# EasyEDA Pro project 4040M主控板.eprj, board PCB
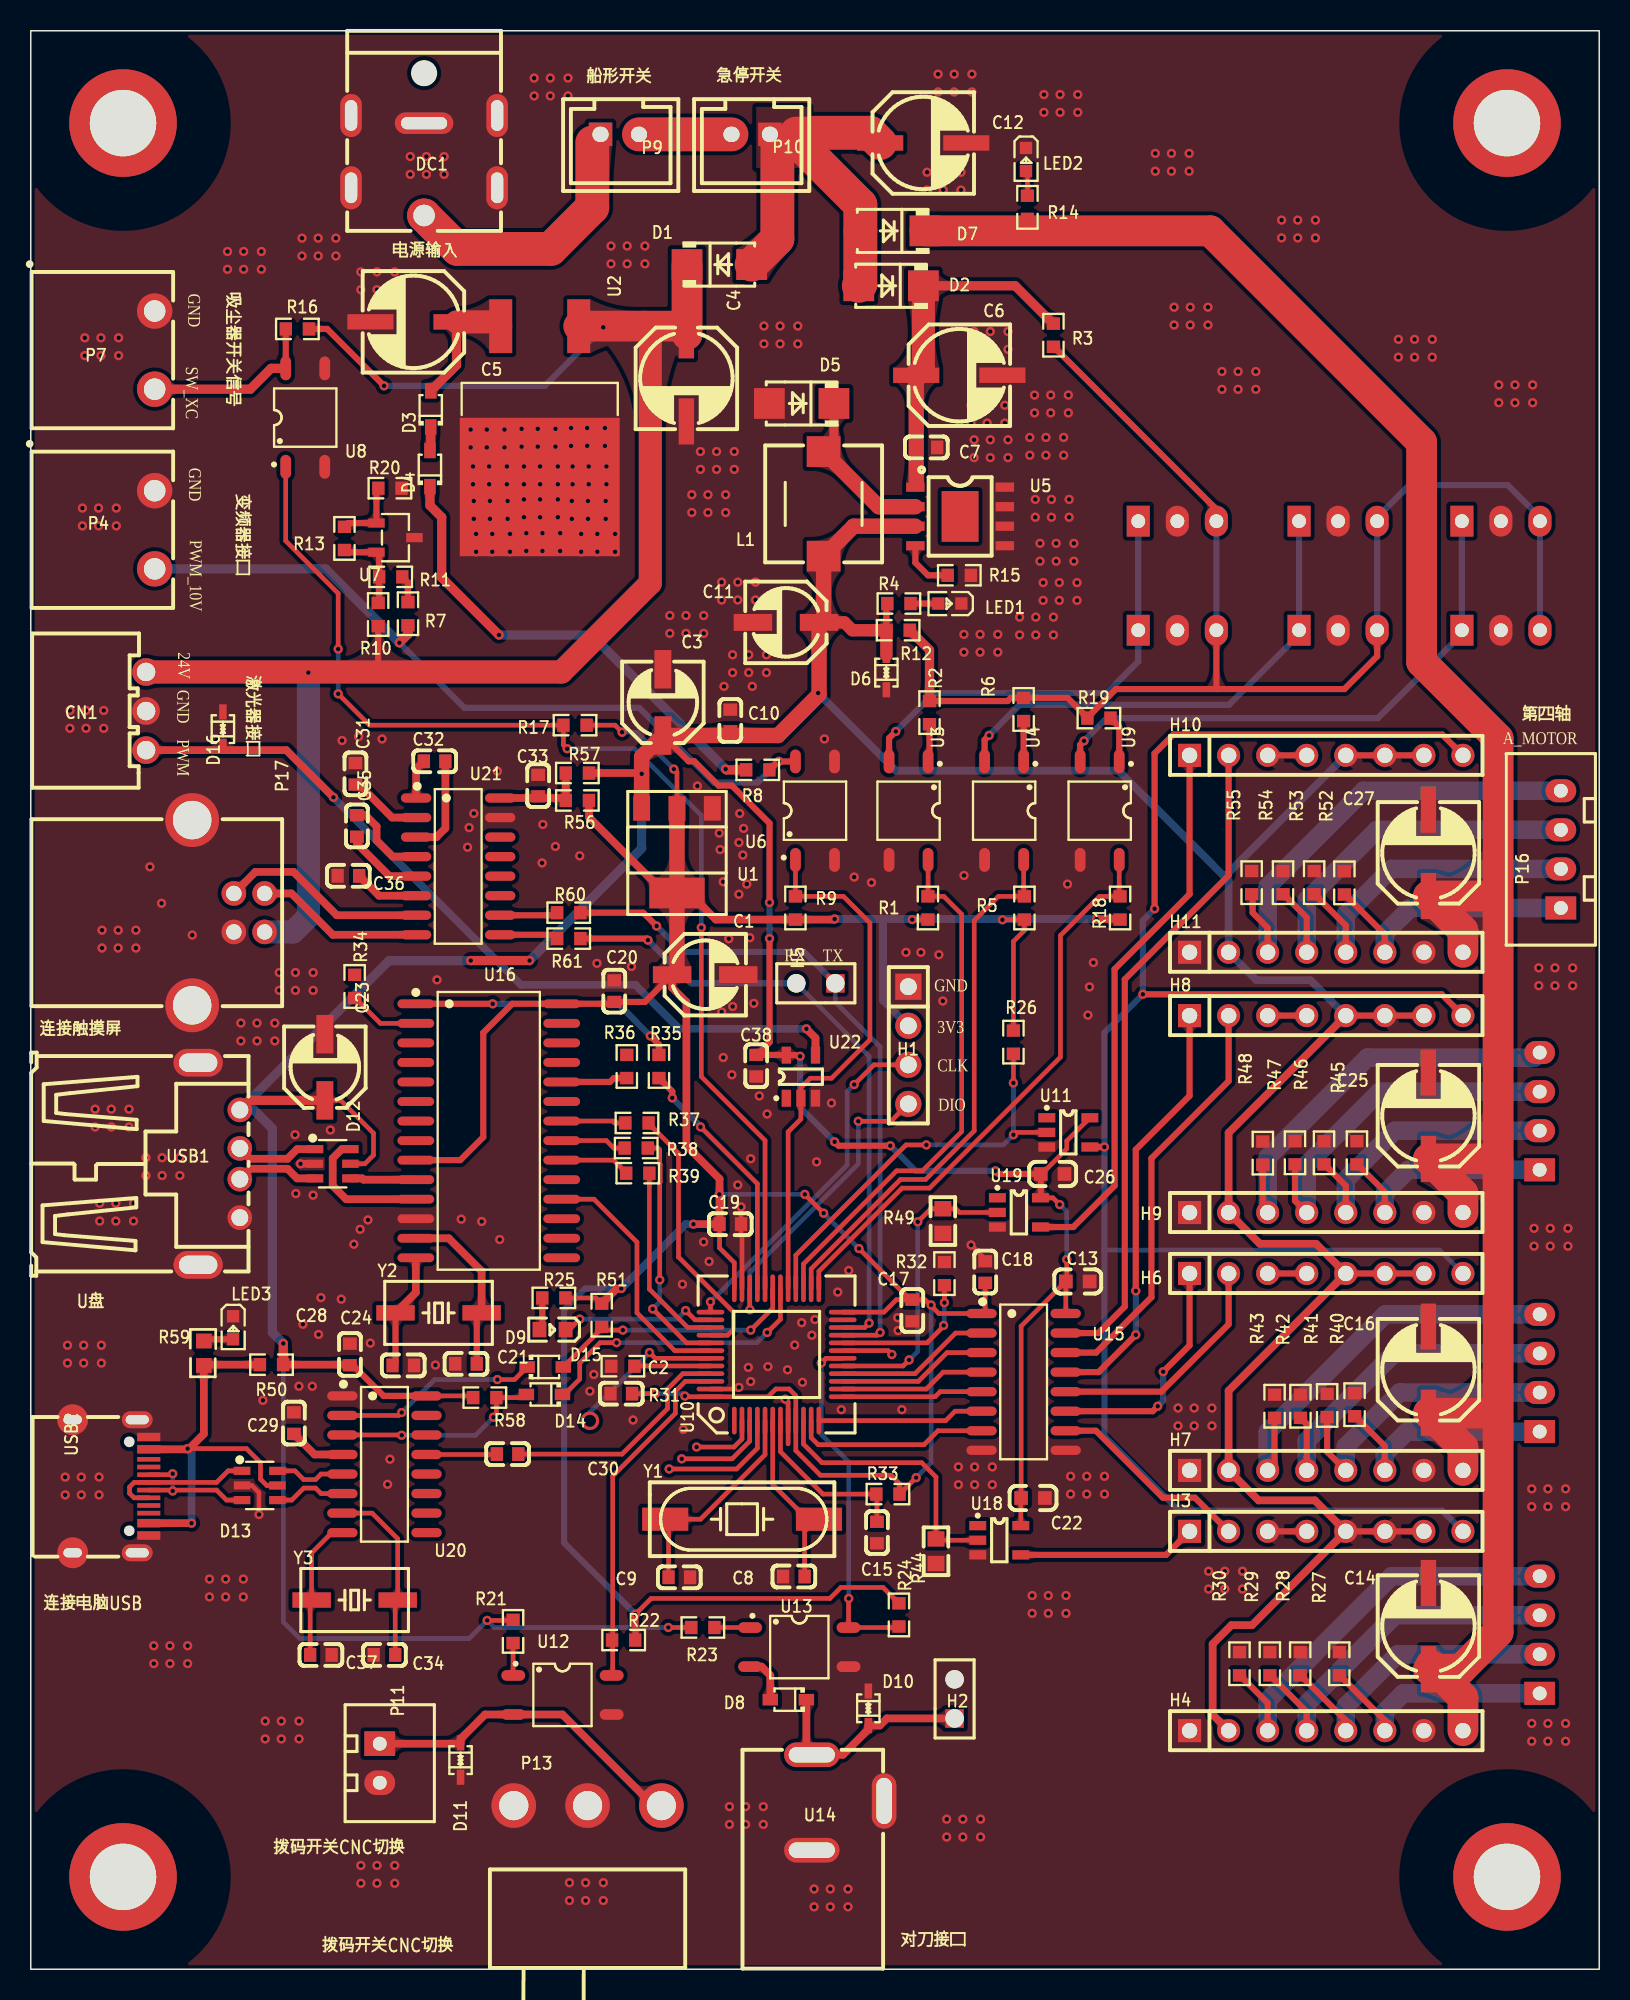
[diagram p1: board, top side]
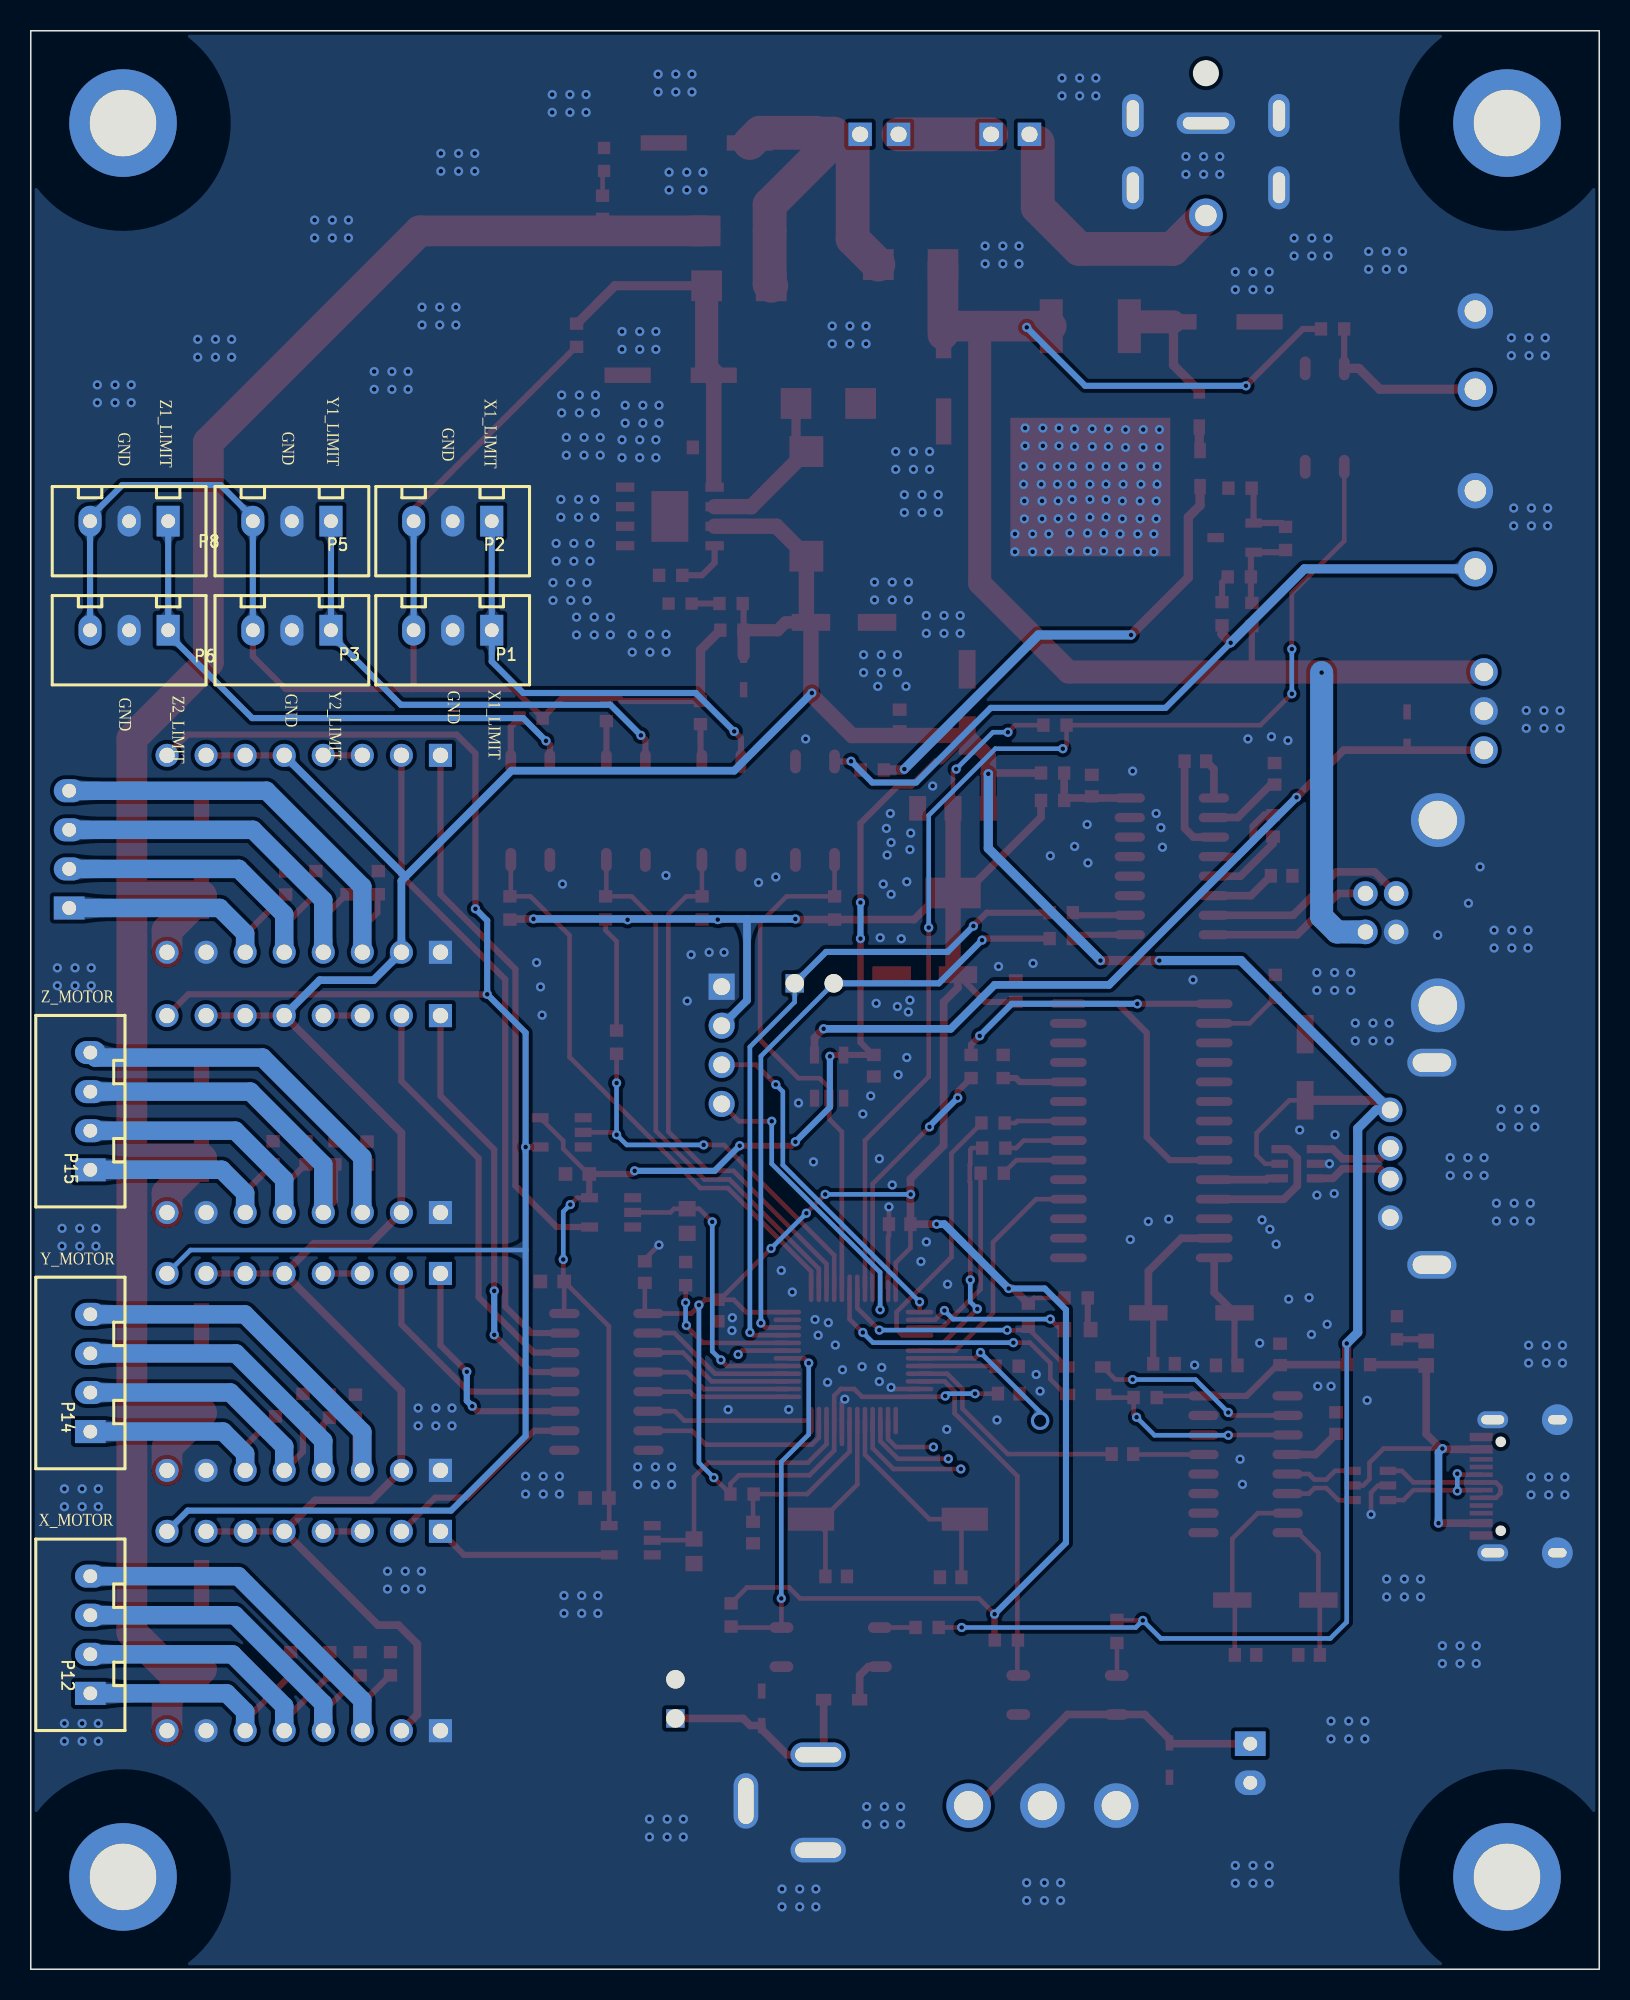
[diagram p2: board, bottom side, seen from below]

Outline 102 x 126 mm; copper layers: Top Layer, Bottom Layer. Coordinates in mm from the lower left corner of the outline.
Outline path: rectangle 0,126 102,0
Stack: Top Layer 0.035mm / Dielectric1 1.51mm FR4 er 4.5 / Bottom Layer 0.035mm

## Design rules (mm)
net D1-: DP1
net D1+: DP1
net DP_D+: DP2
net DN_D-: DP2
net DP+: DP3
net DN-: DP3
template: 用户自定义配置
spacing Default (default): track to track 0.152, other pairs 0 to 0.152
track width Default (default): min 0.254, default 0.254, max 25.4
differential pair differentialPair (default): width min 0.127, default 0.254, max 2.54; gap min 0.152, default 0.152
via Default (default): diameter min 0.25, default 0.61, max 100.025; hole min 0.2, default 0.305, max 59.995

## Placement (name value [footprint] x y rotation side)
C1  100uF/10V  [CAP-SMD_BD5.0-L5.3-W5.3-RD]  43.86 64.65 180 top
C2  0.1uF  [C0603]  38.4 37.41 0 top
C3  100uF/10V  [CAP-SMD_BD5.0-L5.3-W5.3-RD]  41.11 82.34 270 top
C4  100uF/35V  [电解电容贴片6X6]  42.64 103.41 270 top
C5  100uF/35V  [电解电容贴片6X6]  24.89 107.08 180 top
C6  100uF/35V  [电解电容贴片6X6]  60.38 103.61 0 top
C7  0.1uF  [C0603]  58.24 98.92 0 top
C8  33pF  [C0603]  49.62 25.53 0 top
C9  33pF  [C0603]  42.18 25.48 180 top
C10  0.1uF  [C0603]  45.49 81.17 270 top
C11  100uF/10V  [CAP-SMD_BD5.0-L5.3-W5.3-RD]  49.11 87.55 0 top
C12  100uF/35V  [电解电容贴片6X6]  58.04 118.71 0 top
C13  104  [0603C]  68.09 44.7 180 top
C14  100uF/35V  [电解电容贴片6X6]  90.89 22.3 90 top
C15  0.1uF  [C0603]  55.03 28.38 90 top
C16  100uF/35V  [电解电容贴片6X6]  90.89 38.97 90 top
C17  0.1uF  [C0603]  57.32 42.82 270 top
C18  0.1uF  [C0603]  62.07 45.32 90 top
C19  0.1uF  [C0603]  45.49 48.43 0 top
C20  0.1uF  [C0603]  37.94 63.58 90 top
C21  33pF  [C0603]  28.3 39.35 0 top
C22  104  [0603C]  65.18 30.63 180 top
C23  100uF/10V  [CAP-SMD_BD5.0-L5.3-W5.3-RD]  19.12 58.63 270 top
C24  33pF  [C0603]  24.22 39.25 180 top
C25  100uF/35V(47uF/50V)  [电解电容贴片6X6]  90.89 55.48 90 top
C26  104  [0603C]  66.45 51.69 180 top
C27  100uF/35V  [电解电容贴片6X6]  90.89 72.56 90 top
C28  0.1uF  [C0603]  20.76 39.96 90 top
C29  0.1uF  [C0603]  17.11 35.5 90 top
C30  0.1uF  [C0603]  31.01 33.48 180 top
C31  0.1uF  [C0603]  21.11 77.7 270 top
C32  0.1uF  [C0603]  26.27 78.52 0 top
C33  0.1uF  [C0603]  33 76.94 270 top
C34  33pF  [C0603]  23 20.43 0 top
C35  0.1uF  [C0603]  21.21 74.31 270 top
C36  0.1uF  [C0603]  20.66 71.07 180 top
C37  33pF  [C0603]  18.87 20.43 180 top
C38  0.1uF  [C0603]  47.18 58.73 90 top
CN1  XH-3AW  [CONN-TH_3P-P2.54_HCTL_XH-3AW]  7.5 81.78 90 top
D1  SS56  [SMA]  44.78 110.8 0 top
D2  SS56  [SMA]  55.95 109.42 180 top
D3  1N4148  [SOD-323_L1.8-W1.3-LS2.5-RD]  26.01 101.42 90 top
D4  1N4148  [SOD-323_L1.8-W1.3-LS2.5-RD]  25.96 97.54 90 top
D5  SS56  [SMA]  50.13 101.77 180 top
D6  PESD5V0L1BA-N  [SOD-323_L1.8-W1.3-LS2.5-BI]  55.64 84.28 90 top
D7  SS56  [SMA]  56.05 112.99 180 top
D8  1N4148  [SOD-323_L1.8-W1.3-LS2.5-RD]  49.27 17.52 180 top
D9  绿光  [0603LED]  33.97 41.59 0 top
D10  PESD5V0L1BA-N  [SOD-323_L1.8-W1.3-LS2.5-BI]  54.47 16.96 270 top
D11  PESD5V0L1BA-N  [SOD-323_L1.8-W1.3-LS2.5-BI]  27.95 13.59 90 top
D12  USBLC6-2SC6  [SOT-23-6_L2.9-W1.6-P0.95-LS2.8-BL]  19.63 52.36 270 top
D13  USBLC6-2SC6  [SOT-23-6_L2.9-W1.6-P0.95-LS2.8-BL]  14.89 31.44 270 top
D14  1N4148  [SOD-323_L1.8-W1.3-LS2.5-RD]  33.4 37.36 180 top
D15  1N4148  [SOD-323_L1.8-W1.3-LS2.5-RD]  33.46 39.15 0 top
D16  PESD5V0L1BA-N  [SOD-323_L1.8-W1.3-LS2.5-BI]  12.5 80.61 90 top
DC1  DC007B-2.5  [DC-IN-TH_HX-DC007B-2.5]  25.58 117.24 270 top
H1  PZ254  [HDR-TH_4P-P2.54-V-M]  57.07 60.06 270 top
H2  PZ254V-11-02P  [HDR-TH_2P-P2.54-V-M]  60.08 17.57 90 top
H3  PZ254V-11-08P  [HDR-TH_8P-P2.54-V-M]  84.25 28.46 0 top
H4  PZ254V-11-08P  [HDR-TH_8P-P2.54-V-M]  84.25 15.51 0 top
H5  PZ254V-11-02P  [HDR-TH_2P-P2.54-V-M]  51.05 64.09 180 top
H6  PZ254V-11-08P  [HDR-TH_8P-P2.54-V-M]  84.25 45.22 0 top
H7  PZ254V-11-08P  [HDR-TH_8P-P2.54-V-M]  84.25 32.42 0 top
H8  PZ254V-11-08P  [HDR-TH_8P-P2.54-V-M]  84.25 61.99 0 top
H9  PZ254V-11-08P  [HDR-TH_8P-P2.54-V-M]  84.25 49.19 0 top
H10  PZ254V-11-08P  [HDR-TH_8P-P2.54-V-M]  84.25 78.9 0 top
H11  PZ254V-11-08P  [HDR-TH_8P-P2.54-V-M]  84.25 66.1 0 top
L1  68uH  [IND-SMD_L7.0-W7.0_SMDRI74-330MT]  51.56 95.25 90 top
LED1  绿光  [LED0603-RD]  59.77 88.77 180 top
LED2  绿光  [LED0603-RD]  64.72 117.64 270 top
LED3  绿光  [LED0603-RD]  13.16 41.7 270 top
NOREF  -  [Pad_ie6515]  6 6 180 top
NOREF#2  -  [Pad_ie6511]  6 120 180 top
NOREF#3  -  [Pad_ie6513]  96 120 180 top
NOREF#4  -  [Pad_ie6514]  96 6 180 top
P1  3P  [HDR1X3_CON]  74.56 87.04 0 bottom
P2  3P  [HDR1X3_CON]  74.56 94.12 0 bottom
P3  3P  [HDR1X3_CON]  85.02 87.04 0 bottom
P4  5.08-2P  [CONN-TH_KF2EDG15R-5.08-2P]  8.06 93.56 270 top
P5  3P  [HDR1X3_CON]  85.02 94.12 0 bottom
P6  3P  [HDR1X3_CON]  95.6 87.04 0 bottom
P7  5.08-2P  [CONN-TH_KF2EDG15R-5.08-2P]  8.06 105.24 270 top
P8  3P  [HDR1X3_CON]  95.6 94.12 0 bottom
P9  XH2.54-2P  [CONN-TH_XH2.54-2P]  38.3 119.27 180 top
P10  XH2.54-2P  [CONN-TH_XH2.54-2P]  46.82 119.27 180 top
P11  2P  [HDR1X2_CON]  22.69 13.39 270 top
P12  4P  [HDR1X4_CON]  98.12 17.93 90 bottom
P13  SS12D10G5-WJ  [SW-TH_3P-SS12D06-1]  36.21 10.64 0 top
P14  4P  [HDR1X4_CON]  98.12 34.95 90 bottom
P15  4P  [HDR1X4_CON]  98.12 51.96 90 bottom
P16  4P  [HDR1X4_CON]  99.5 68.98 90 top
P17  USB-B10-BRW  [USB-B-TH_USB-B10-BRW]  12.85 68.68 270 top
R1  47K  [R0603]  58.34 68.98 90 top
R2  4.7K  [R0603]  58.45 81.68 270 top
R3  0Ω  [R0603]  66.5 106.21 270 top
R4  0Ω  [R0603]  56.41 87.04 0 top
R5  47K  [R0603]  64.62 68.98 90 top
R6  4.7K  [R0603]  64.57 81.88 270 top
R7  0Ω  [R0603]  24.53 88.11 270 top
R8  2kΩ  [R0603]  47.28 77.96 180 top
R9  47K  [R0603]  49.73 68.98 90 top
R10  1kΩ  [R0603]  22.59 88.06 270 top
R11  1kΩ  [R0603]  23.41 90.5 180 top
R12  20kΩ  [R0603]  56.46 88.77 180 top
R13  15kΩ  [R0603]  20.4 93 90 top
R14  47kΩ  [R0603]  64.81 114.52 270 top
R15  10kΩ  [R0603]  60.38 90.61 180 top
R16  10K  [R0603]  17.34 106.62 0 top
R17  47K  [R0603]  35.39 80.86 180 top
R18  47K  [R0603]  70.84 68.98 90 top
R19  4.7K  [R0603]  69.46 81.32 0 top
R20  5.1kΩ  [R0603]  23.36 96.27 0 top
R21  200Ω  [R0603]  31.36 21.96 270 top
R22  10K  [R0603]  38.56 21.4 180 top
R23  200Ω  [R0603]  43.71 22.21 0 top
R24  10K  [R0603]  56.46 23.03 270 top
R25  10K  [R0603]  34.02 43.63 180 top
R26  10K  [R0603]  63.9 60.26 270 top
R27  2k  [R0603]  85.09 19.86 270 top
R28  2k  [R0603]  82.55 19.86 270 top
R29  2k  [R0603]  80.58 19.86 270 top
R30  2k  [R0603]  78.61 19.86 270 top
R31  10K  [R0603]  38.51 39.2 180 top
R32  10K  [R0603]  59.42 45.21 90 top
R33  10K  [R0603]  55.74 30.88 0 top
R34  0Ω  [R0603]  21.06 63.88 270 top
R35  0Ω  [R0603]  40.85 58.68 90 top
R36  0Ω  [R0603]  38.76 58.68 90 top
R37  0Ω  [R0603]  39.42 55.01 0 top
R38  0Ω  [R0603]  39.37 53.38 0 top
R39  0Ω  [R0603]  39.47 51.74 0 top
R40  2k  [R0603]  86.09 36.7 270 top
R41  2k  [R0603]  84.3 36.65 270 top
R42  2k  [R0603]  82.57 36.6 270 top
R43  2k  [R0603]  80.89 36.6 270 top
R44  10K  [0603R]  58.87 27.17 270 top
R45  2k  [R0603]  86.24 53.07 270 top
R46  2k  [R0603]  84.1 53.07 270 top
R47  2k  [R0603]  82.21 53.07 270 top
R48  2k  [R0603]  80.12 53.05 270 top
R49  10K  [0603R]  59.31 48.63 270 top
R50  0Ω  [R0603]  15.66 39.3 0 top
R51  10K  [R0603]  37.13 42.51 90 top
R52  2k  [R0603]  85.43 70.61 270 top
R53  2k  [R0603]  83.46 70.63 270 top
R54  2k  [R0603]  81.44 70.63 270 top
R55  2k  [R0603]  79.4 70.63 270 top
R56  0Ω  [R0603]  35.55 75.97 0 top
R57  0Ω  [R0603]  35.55 77.75 0 top
R58  10K  [R0603]  29.53 37.16 180 top
R59  47K  [10]  11.37 39.15 90 top
R60  0Ω  [R0603]  34.99 68.68 0 top
R61  0Ω  [R0603]  34.99 66.99 0 top
U1  1117-3.3  [SOT-223]  42.02 72.76 180 top
U2  CJ7812  [TO-263-2_L10.1-W9.1-P5.08-LS15.2-TL]  33.1 101.57 270 top
U3  LTV-357T-C  [SOP-4_L4.4-W3.9-P2.54-LS7.0-TL]  57.08 75.31 270 top
U4  LTV-357T-C  [SOP-4_L4.4-W3.9-P2.54-LS7.0-TL]  63.3 75.31 270 top
U5  XL1509-5.0E1  [ESOP-8_L4.9-W3.9-P1.27-LS6.0-BL-EP]  60.44 94.43 270 top
U6  LTV-357T-C  [SOP-4_L4.4-W3.9-P2.54-LS7.0-TL]  51 75.31 90 top
U7  TL431  [SOT-23-3_L2.9-W1.6-P1.90-LS2.8-BR]  23.72 93.05 180 top
U8  LTV-357T-C  [SOP-4_L4.4-W3.9-P2.54-LS7.0-TL]  17.85 100.86 90 top
U9  LTV-357T-C  [SOP-4_L4.4-W3.9-P2.54-LS7.0-TL]  69.51 75.31 270 top
U10  GD32F303CCT6  [LQFP48]  48.5 39.96 90 top
U11  74LVC1G17  [SOT-23-5]  67.47 54.4 0 top
U12  LTV-357T-C  [SOP-4_L4.4-W3.9-P2.54-LS7.0-TL]  34.58 17.83 0 top
U13  LTV-357T-C  [SOP-4_L4.4-W3.9-P2.54-LS7.0-TL]  49.98 20.94 0 top
U14  XDJK-0051-025  [DC-IN-TH_XDJK-0051-025]  53.14 10.84 90 top
U15  CA-IS3760  [SOIC-16_L9.9-W3.9-P1.27-LS6.0-BL]  64.57 38.18 270 top
U16  CH376S  [SOIC-28_L17.9-W7.5-P1.27-LS10.3-BL]  29.78 54.5 270 top
U18  74LVC1G17  [SOT-23-5]  62.98 27.88 0 top
U19  74LVC1G17  [SOT-23-5]  64.26 49.19 0 top
U20  CH340G  [SOIC-16_L9.9-W3.9-P1.27-LS6.0-BL]  23 32.82 270 top
U21  SP3232EEN-L/TR  [SOIC-16_L9.9-W3.9-P1.27-LS6.0-BL]  27.8 71.68 270 top
U22  74LVC1G17  [SOT-23-5]  50.08 58.02 90 top
USB1  U-USBAR04P-F002  [USB-A-TH_USB-302-T]  12.24 52.36 270 top
USB2  TYPE-C 16PIN  [USB-C-SMD_TYPE-C-6PIN+]  5.1 31.39 270 top
Y1  8M  [晶振贴片]  46.26 29.25 0 top
Y2  12M  [晶振贴片49SSMD]  26.52 42.66 0 top
Y3  12M  [晶振贴片49SSMD]  21.06 24 0 top

## Footprints (pads in the part's own frame, mm; a bottom-side part is the same pattern mirrored in y, then rotated)
10
  rect 0.965x1.016 smd: 1(0.101,0.117) 2(1.688,0.117)
0603C
  rect 0.889x0.889 smd: 1(-0.774,0) 2(0.774,0)
0603LED
  rect 0.9x1 smd: 1(-0.884,-0.017) 2(0.816,-0.017)
0603R
  rect 1x1.1 smd: 1(-0.8,0) 2(0.8,0)
C0603
  rect 0.8x0.9 smd: 1(-0.7,0) 2(0.7,0)
CAP-SMD_BD5.0-L5.3-W5.3-RD
  rect 2.5x1.1 smd: 1(2.15,0) 2(-2.15,0)
CONN-TH_3P-P2.54_HCTL_XH-3AW
  round 1.8 hole 1.199: 1(-2.54,0) 2(0.002,0) 3(2.54,0)
CONN-TH_KF2EDG15R-5.08-2P
  round 2.3 hole 1.4: 1(-2.54,0) 2(2.54,0)
CONN-TH_XH2.54-2P
  rect 1.524x1.524 hole 1.05x1: 1(-1.25,0) 2(1.25,0)
DC-IN-TH_HX-DC007B-2.5
  round 2.2 hole 1.4: 1(3.25,0)
  oval 1.4x3.8 hole 0.8x3: 2(-2.75,0)
  oval 2.8x1.4 hole 2x0.8: 3(-3.25,4.75) 3(-3.25,-4.75) 3(1.45,4.75) 3(1.45,-4.75)
DC-IN-TH_XDJK-0051-025
  oval 1.6x3.6 hole 1x3: 1(3.1,2.35) 2(-3.1,2.35)
  oval 3.6x1.6 hole 3x1: 3(0.1,-2.35)
ESOP-8_L4.9-W3.9-P1.27-LS6.0-BL-EP
  rect 0.6x1.2 smd: 1(-1.905,-2.909) 2(-0.635,-2.909) 3(0.635,-2.909) 4(1.905,-2.909) 5(1.905,2.909) 6(0.635,2.909) 7(-0.635,2.909) 8(-1.905,2.909)
  rect 3.3x2.4 smd: 9(0,0)
HDR1X2_CON
  rect 1.6x2 hole 0.9: 1(-1.27,0)
  oval 1.6x2 hole 0.9: 2(1.27,0)
HDR1X3_CON
  rect 1.5x2 hole 0.9: 1(-2.54,0)
  oval 1.5x2 hole 0.9: 2(0,0) 3(2.54,0)
HDR1X4_CON
  rect 1.5x2 hole 0.9: 1(0,0)
  oval 1.5x2 hole 0.9: 2(2.54,0) 3(5.08,0) 4(7.62,0)
HDR-TH_2P-P2.54-V-M
  rect 1.2x1.2 hole 1.2x0.8: 1(-1.27,0)
  round 1.2 hole 1.2x0.8: 2(1.27,0)
HDR-TH_4P-P2.54-V-M
  rect 1.7x1.7 hole 1.1: 1(-3.81,0)
  round 1.7 hole 1.1: 2(-1.27,0) 3(1.27,0) 4(3.81,0)
HDR-TH_8P-P2.54-V-M
  rect 1.5x1.5 hole 1: 1(-8.89,0)
  round 1.5 hole 1: 2(-6.35,0) 3(-3.81,0) 4(-1.27,0) 5(1.27,0) 6(3.81,0) 7(6.35,0) 8(8.89,0)
IND-SMD_L7.0-W7.0_SMDRI74-330MT
  rect 2x2.2 smd: 1(-3.4,0) 2(3.4,0)
LED0603-RD
  rect 0.8x0.8 smd: 1(-0.749,0) 2(0.749,0)
LQFP48
  oval 1.8x0.3 smd: 1(-4.3,2.75) 2(-4.3,2.25) 3(-4.3,1.75) 4(-4.3,1.25) 5(-4.3,0.75) 6(-4.3,0.25) 7(-4.3,-0.25) 8(-4.3,-0.75) 9(-4.3,-1.25) 10(-4.3,-1.75) 11(-4.3,-2.25) 12(-4.3,-2.75) 25(4.3,-2.75) 26(4.3,-2.25) 27(4.3,-1.75) 28(4.3,-1.25) 29(4.3,-0.75) 30(4.3,-0.25) 31(4.3,0.25) 32(4.3,0.75) 33(4.3,1.25) 34(4.3,1.75) 35(4.3,2.25) 36(4.3,2.75)
  oval 0.3x1.8 smd: 13(-2.75,-4.3) 14(-2.25,-4.3) 15(-1.75,-4.3) 16(-1.25,-4.3) 17(-0.75,-4.3) 18(-0.25,-4.3) 19(0.25,-4.3) 20(0.75,-4.3) 21(1.25,-4.3) 22(1.75,-4.3) 23(2.25,-4.3) 24(2.75,-4.3) 37(2.75,4.3) 38(2.25,4.3) 39(1.75,4.3) 40(1.25,4.3) 41(0.75,4.3) 42(0.25,4.3) 43(-0.25,4.3) 44(-0.75,4.3) 45(-1.25,4.3) 46(-1.75,4.3) 47(-2.25,4.3) 48(-2.75,4.3)
Pad_ie6511
  round 7 hole 4.32: 0(0,0)
Pad_ie6513
  round 7 hole 4.32: 0(0,0)
Pad_ie6514
  round 7 hole 4.32: 0(0,0)
Pad_ie6515
  round 7 hole 4.32: 0(0,0)
R0603
  rect 0.806x0.864 smd: 1(-0.753,0) 2(0.753,0)
SMA
  rect 2x2 smd: 1(2.1,0) 2(-2.1,0)
SOD-323_L1.8-W1.3-LS2.5-BI
  rect 0.986x0.49 smd: 1(-1.117,0) 2(1.117,0)
SOD-323_L1.8-W1.3-LS2.5-RD
  rect 1x0.75 smd: 1(-1.173,0) 2(1.173,0)
SOIC-16_L9.9-W3.9-P1.27-LS6.0-BL
  oval 0.602x1.971 smd: 1(-4.445,-2.736) 2(-3.175,-2.736) 3(-1.905,-2.736) 4(-0.635,-2.736) 5(0.635,-2.736) 6(1.905,-2.736) 7(3.175,-2.736) 8(4.445,-2.736) 9(4.445,2.736) 10(3.175,2.736) 11(1.905,2.736) 12(0.635,2.736) 13(-0.635,2.736) 14(-1.905,2.736) 15(-3.175,2.736) 16(-4.445,2.736)
SOIC-28_L17.9-W7.5-P1.27-LS10.3-BL
  oval 0.574x2.388 smd: 1(-8.255,-4.744) 2(-6.985,-4.744) 3(-5.715,-4.744) 4(-4.445,-4.744) 5(-3.175,-4.744) 6(-1.905,-4.744) 7(-0.635,-4.744) 8(0.635,-4.744) 9(1.905,-4.744) 10(3.175,-4.744) 11(4.445,-4.744) 12(5.715,-4.744) 13(6.985,-4.744) 14(8.255,-4.744) 15(8.255,4.744) 16(6.985,4.744) 17(5.715,4.744) 18(4.445,4.744) 19(3.175,4.744) 20(1.905,4.744) 21(0.635,4.744) 22(-0.635,4.744) 23(-1.905,4.744) 24(-3.175,4.744) 25(-4.445,4.744) 26(-5.715,4.744) 27(-6.985,4.744) 28(-8.255,4.744)
SOP-4_L4.4-W3.9-P2.54-LS7.0-TL
  oval 1.55x0.7 smd: 1(-3.2,1.27) 2(-3.2,-1.27) 3(3.2,-1.27) 4(3.2,1.27)
SOT-23-3_L2.9-W1.6-P1.90-LS2.8-BR
  rect 1.07x0.6 smd: 1(1.235,-0.95) 2(1.235,0.95) 3(-1.235,0)
SOT-23-5
  rect 1.1x0.6 smd: 1(-1.4,0.95) 2(-1.4,0) 3(-1.4,-0.95) 4(1.4,-0.95) 5(1.4,0.95)
SOT-23-6_L2.9-W1.6-P0.95-LS2.8-BL
  rect 0.532x1.072 smd: 1(-0.95,-1.149) 2(0,-1.149) 3(0.95,-1.149) 4(0.95,1.149) 5(0,1.149) 6(-0.95,1.149)
SOT-223
  rect 1.1x1.6 smd: 1(-2.3,-2.7) 2(0,-2.7) 3(2.3,-2.7)
  rect 3.6x2 smd: 4(0,2.8)
SW-TH_3P-SS12D06-1
  round 2.9 hole 1.9: 1(-4.8,0) 2(0,0) 3(4.8,0)
TO-263-2_L10.1-W9.1-P5.08-LS15.2-TL
  rect 3.5x1.5 smd: 1(-5.228,2.54) 3(-5.228,-2.54)
  rect 9x10.4 smd: 2(5.228,0)
USB-A-TH_USB-302-T
  round 1.6 hole 1.1: 1(-3.5,1.355) 2(-1,1.355) 3(1,1.355) 4(3.5,1.355)
  oval 1.8x3.2 hole 1.2x2.5: 5(-6.57,-1.355) 6(6.57,-1.355)
USB-B-TH_USB-B10-BRW
  round 1.6 hole 1: 1(1.25,2.355) 2(-1.25,2.355) 3(-1.25,0.355) 4(1.25,0.355)
  round 3.5 hole 2.5: 5(-6.02,-2.355) 6(6.02,-2.355)
USB-C-SMD_TYPE-C-6PIN+
  rect 0.55x1.5 smd: 1(-3.2,2.575) 2(-2.4,2.575) 11(2.4,2.575) 12(3.2,2.575)
  rect 0.3x1.5 smd: 3(-1.75,2.575) 4(-1.25,2.575) 5(-0.75,2.575) 6(-0.25,2.575) 7(0.25,2.575) 8(0.75,2.575) 9(1.25,2.575) 10(1.75,2.575)
  oval 1.1x2 hole 0.6x1.5: 13(-4.325,1.825) 14(4.325,1.825)
  oval 2x2 hole 0.6x1.2: 13(-4.325,-2.375) 14(4.325,-2.375)
晶振贴片
  rect 3x1.5 smd: 1(-5,0) 2(5,0)
晶振贴片49SSMD
  rect 2.5x1 smd: 1(-2.8,0) 2(2.8,0)
电解电容贴片6X6
  rect 3x1 smd: 1(-2.8,0) 2(2.8,0)

## Nets
As in the schematic, except:
12V: C5.1 D3.2 U2.3
24V_D2: C14.1 C16.1 C25.1 C27.1 D7.2 H4.8 H7.8 H9.8 H11.8 R14.2
24V_D4: C4.1 CN1.3 D1.2 P17.1 R10.2 R16.2 U2.1
24V_VCC: C12.1 D1.1 D2.1 D7.1 P10.1
GND: C1.2 C2.1 C3.2 C4.2 C5.2 C6.2 C7.2 C8.1 C9.1 C10.1 C11.2 C12.2 C13.1 C14.2 C15.1 C16.2 C17.2 C18.2 C19.2 C20.2 C21.1 C22.1 C23.2 C24.1 C25.2 C26.1 C27.2 C28.2 C29.2 C31.1 C33.1 C34.1 C36.2 C37.1 C38.1 CN1.2 D5.1 D6.1 D10.1 D11.1 D12.2 D13.2 D16.2 DC1.2 DC1.3 H1.1 H2.2 H4.1 H4.7 H7.1 H7.7 H9.1 H9.7 H11.1 H11.7 LED1.1 LED2.1 LED3.1 P1.2 P2.2 P3.2 P4.1 P5.2 P6.2 P7.1 P8.2 P11.2 P13.1 P13.2 P17.4 P17.5 P17.6 R15.1 R20.2 R27.1 R28.1 R29.1 R30.1 R31.2 R32.2 R40.1 R41.1 R42.1 R43.1 R44.2 R45.1 R46.1 R47.1 R48.1 R49.2 R52.1 R53.1 R54.1 R55.1 U1.1 U2.2 U3.3 U4.3 U5.5 U5.6 U5.7 U5.8 U6.2 U6.3 U7.3 U8.2 U8.3 U9.3 U10.8 U10.23 U10.35 U10.47 U11.3 U12.3 U13.3 U14.2 U14.3 U15.8 U15.9 U16.12 U18.3 U19.3 U20.1 U21.15 U22.3 USB1.4 USB1.5 USB1.6 USB2.1 USB2.12 USB2.13 USB2.14
VCC_10V: D4.1 R8.2
PWM: R9.2 U6.1 U10.29 U22.2
PWM_10V: P4.2 R7.2 R8.1 U6.4
RST: C30.1 U10.45
RST_CH: R34.2 U16.2
VKA: R10.1 R11.2 R13.1 U7.2
$1N103100: R13.2 R20.1 U7.1
$1N107518: D3.1 D4.2
$1N113148: R7.1 R11.1

Pads without a net: NOREF 0; NOREF#2 0; NOREF#3 0; NOREF#4 0; R36 2; U5 9; U10 1; U11 1; U16 3 4 5 6 7 8 15 16 17 19 23 25 26 27; U18 1; U19 1; U20 9 10 11 12 14 15; U22 1; USB2 3 9

## Via types
v1: diameter 0.6, hole 0.3, Top Layer to Bottom Layer, 627 vias
v2: diameter 1.2, hole 0.8, Top Layer to Bottom Layer, 1 via

## Routing (per net, layer and track width the routed paths; a pad name or vN(x,y) marks a point on that pad's centre or on a via; arc(x,y) is an arc through that point)
3V3: length 245.6
  Top Layer w0.3: v1(51.56,49.14) v1(50.34,50.37) ; v1(38.45,80.41) 38,80.86 R17.1 ; U10.24 55.48,42.71 56.29,43.52 57.19,43.52 ; 57.19,43.52 v1(53.86,46.85) ; 57.19,43.52 58.15,43.52 59.05,42.62 61.83,42.62 62.07,42.86 C18.1 ; R25.1 36.76,43.63 R51.2 ; 58.34,68.23 v1(57.32,68.23) ; 63.9,61.01 63.9,66.81 64.62,67.52 64.62,68.23 64.61,68.22 v1(63.19,68.22) ; C2.2 v1(40.6,37.41) ; v1(41.82,78.01) 42.02,77.8 U1.2 ; R24.1 55.43,24.81 52.68,24.81 51.97,24.1 40.34,24.1 v1(39.32,23.08) ; v1(42.53,37.26) 42.58,37.21 U10.48 47.94,37.21 48.45,37.72 49.32,37.72 49.75,37.28 U10.9 49.75,33.71 51.36,32.11 55.95,32.11 56.5,31.56 R33.2 57.57,31.95 v1(57.58,31.95) ; U10.36 45.75,45.92 44.79,46.88 C19.1
  Top Layer w0.4: v1(39.32,23.08) 39.32,21.41 R22.1 ; C1.1 39.94,62.88 C20.1 37.82,62.75 U16.28 31.31,62.75 29.43,60.87 29.43,54.09 27.93,52.59 U16.9
  Top Layer w0.5: v1(38.4,44.25) 38.11,44.25 R51.2 ; 70.84,68.23 70.8,68.27 v1(69.31,68.27) ; R56.2 36.3,74.88 41.22,69.96 U1.4 42.82,69.96 44.55,68.23 52.24,68.23 v1(52.28,68.27) ; C1.1 41.71,63.8 42.64,62.87 42.64,53.53 44.79,51.37 C19.1 v1(43.1,48.43)
  Top Layer w1: U1.2 U1.4 42.02,64.96 C1.1
  Bottom Layer w0.3: v1(42.53,37.26) 42.38,37.41 v1(40.6,37.41) ; v1(57.58,31.95) 58.55,32.92 v1(58.55,43.17) ; v1(41.82,78.01) 39.42,80.41 v1(38.45,80.41) ; v1(50.34,50.37) v1(44.78,50.37) ; v1(53.86,46.85) v1(51.56,49.14)
  Bottom Layer w0.4: v1(38.4,44.25) 36.06,44.25 34.68,42.87 34.68,27.72 v1(39.32,23.08)
  Bottom Layer w0.5: v1(38.4,44.25) 42.59,48.43 v1(43.1,48.43) ; H1.2 55.42,62.97 55.42,68.27 ; v1(69.31,68.27) 55.42,68.27 ; 55.42,68.27 v1(52.28,68.27)
5V_USB: length 27.2
  Top Layer w0.3: 10.3,33.84 14.02,33.84 14.94,32.92 14.94,31.85 15.35,31.44 D13.5
  Top Layer w0.5: USB2.11 v1(10.45,28.99) ; USB2.2 10.25,33.79 11.26,34.8 R59.1 11.31,39.3 R50.1
  Bottom Layer w0.5: v1(10.2,33.84) 10.45,33.59 v1(10.45,28.99)
5V_VCC: length 400
  Top Layer w0.3: U20.16 28.67,37.27 R58.2 ; U19.5 66.47,50.14 v1(66.91,49.7) ; 67.31,44.7 67.37,44.77 v1(67.37,46.13) ; 67.31,44.7 64.4,41.8 C22.2 64.38,30.61 U18.5 ; 67.31,44.7 67.31,42.63 67.3,42.62 ; v1(29.68,22.67) 31.33,22.67 R21.1 ; D12.5 21.73,52.36 22.29,52.92 22.29,54.34 20.15,56.48 C23.1 ; v1(41.46,22.21) R23.1 ; U11.5 67.37,53.84 67.37,53.32 65.74,51.69 65.68,51.69
  Top Layer w0.4: 47.23,59.43 49.12,59.43 U22.5 49.96,59.42 v1(50.03,59.34) ; 47.23,59.43 C38.2 ; 47.23,59.43 48.04,60.25 v1(48.04,66.99) ; v1(48.04,69.34) 48.04,74.49 45.59,76.94 44.73,76.94 43.15,78.52 42.78,78.52 C3.1 ; H8.5 H8.6 H8.7 ; U20.16 22.94,37.27 20.95,39.26 C28.1 ; v1(52.28,53.78) 52.53,53.53 v1(55.9,53.53) ; H10.5 H10.6 H10.7 ; H3.7 H3.6 H3.5 ; H6.7 H6.6 H6.5 ; 55.64,87.04 55.64,88.71 R12.2 ; v1(62.73,51.9) 62.93,51.69 65.68,51.69 65.68,50.16 U19.5
  Top Layer w0.5: H8.5 77.9,54.37 H9.2 79.93,47.15 83.59,47.15 H6.5 77.9,37.6 H7.2 79.85,30.48 83.5,30.48 H3.5 79.42,22.37 78.08,22.37 76.86,21.14 76.86,16.55 H4.2 ; C28.1 20.72,39.3 R50.2 ; 39.72,77.7 39.67,77.75 R57.2
  Top Layer w0.6: v1(28.61,65.56) v1(32.44,65.56) ; USB1.1 14.22,56.48 C23.1 ; R50.2 16.42,39.31 v1(16.42,40.68)
  Top Layer w0.8: 55.64,87.04 D6.2 ; 55.64,87.04 53.42,87.04 52.91,87.55 C11.1 ; 55.64,87.04 R4.1
  Top Layer w1: U1.3 39.72,78.81 C3.1 48.6,80.19 51.26,82.86 C11.1 51.56,87.84 L1.1 53.51,93.8 57.53,93.8
  Bottom Layer w0.3: v1(67.37,46.13) 67.37,49.24 v1(66.91,49.7) ; v1(41.46,22.21) 30.14,22.21 v1(29.68,22.67) 28.51,21.5 17.49,21.5 16.42,22.57 v1(16.42,40.68)
  Bottom Layer w0.4: v1(48.04,69.34) v1(48.04,66.99) ; v1(55.9,53.53) 57.53,51.9 v1(62.73,51.9) ; v1(50.03,59.34) 50.03,56.03 v1(52.28,53.78)
  Bottom Layer w0.5: H10.5 77.64,71.02 77.62,71.02 ; 77.62,71.02 77.9,70.75 H11.2 79.71,64.29 83.21,64.29 H8.5 ; 77.62,71.02 70.74,77.91 56.25,77.91 v1(51.2,82.96)
  Bottom Layer w0.6: v1(28.61,65.56) 23.3,65.56 USB1.1 14.5,55.85 15.71,54.65 15.71,41.39 v1(16.42,40.68) ; v1(39.73,77.7) 39.73,72.86 v1(32.44,65.56)
12V: length 8.2
  Top Layer w0.6: C5.1 27.69,104.27 D3.2
  Top Layer w1.5: C5.1 30.28,107.08 U2.3
24V_D1: length 22.5
  Top Layer w0.6: D2.2 64.02,109.42 66.48,106.97 R3.1
  Top Layer w1: C6.1 57.58,96.57
  Top Layer w1.5: D2.2 58.05,104.07 C6.1
24V_D2: length 154.2
  Top Layer w2: 91.3,19.5 91.04,19.77 ; 91.3,19.5 93.02,19.5 95.42,21.91 95.42,80 90.45,84.97 90.45,99.25 76.7,112.99 D7.2 ; 91.3,19.5 C14.1 ; 91.3,19.5 93.14,17.66 H4.8 ; C16.1 90.93,36.14 ; 90.93,36.14 93.14,33.92 H7.8 ; 90.93,36.14 94.81,36.14 ; 95.12,69.7 95.05,69.76 C27.1 93.14,67.52 H11.8 ; 95.17,52.61 95.1,52.68 C25.1 93.14,50.43 H9.8
24V_D4: length 107.6
  Top Layer w0.4: v1(22.98,102.92) 19.28,106.62 R16.2 ; R10.2 22.59,84.74 22.49,84.64
  Top Layer w1.5: CN1.3 34.52,84.32 40.29,90.1 40.29,106.41 39.9,106.8
  Top Layer w2: D1.2 42.68,106.25 ; 42.48,106.62 42.3,106.8 U2.1
  Bottom Layer w0.4: v1(22.98,102.92) 33.43,102.92 v1(37.23,106.72)
  Bottom Layer w1.5: 15.21,67.43 17.06,67.43 18.05,68.42 v1(18.05,84.28)
24V_SW: length 6
  Top Layer w2.2: P9.1 P10.2
24V_VCC: length 25
  Top Layer w2.2: 50.95,119.37 54.58,119.37 C12.1 ; 49.78,118.86 53.95,114.69 D7.1 53.95,109.53 D2.1 ; 48.55,118.35 48.55,112.48 D1.1 ; 50.75,119.32 49.78,119.32
GND: length 15.3
  Top Layer w0.3: D13.2 14.38,31.44 14.84,30.99 v1(14.84,29.56) ; v1(61.15,47.07) 62.07,46.15 C18.2 ; v1(46.05,37.82) 45.95,37.71 U10.47 ; 49.25,34.15 U10.8 49.25,36.87 v1(49.06,37.05) ; U10.35 46.25,47.62 46.19,47.68 C19.2 v1(46.19,49.55)
  Top Layer w0.5: D12.2 v1(17.54,52.36)
  vias: v1(2.24,31.99) v1(2.24,30.83) v1(2.39,40.56) v1(2.39,39.4) v1(2.54,81.82) v1(2.54,80.66) v1(3.29,31.99) v1(3.29,30.83) v1(3.36,94.98) v1(3.36,93.82) v1(3.44,40.56) v1(3.44,39.4) v1(3.51,106.04) v1(3.51,104.89) v1(3.59,81.82) v1(3.59,80.66) v1(4.19,55.91) v1(4.19,54.75) v1(4.41,94.98) v1(4.41,93.82) v1(4.48,49.79) v1(4.48,48.63) v1(4.44,31.99) v1(4.44,30.83) v1(4.56,106.04) v1(4.56,104.89) v1(4.59,40.56) v1(4.59,39.4) v1(4.63,67.54) v1(4.63,66.38) v1(4.75,81.82) v1(4.75,80.66) v1(5.24,55.91) v1(5.24,54.75) v1(5.56,94.98) v1(5.56,93.82) v1(5.53,49.79) v1(5.53,48.63) v1(5.69,67.54) v1(5.69,66.38) v1(5.72,106.04) v1(5.72,104.89) v1(6.39,55.91) v1(6.39,54.75) v1(6.68,49.79) v1(6.68,48.63) v1(6.84,67.54) v1(6.84,66.38) v1(7.49,52.75) v1(7.49,51.59) v1(7.75,71.66) v1(8,21.03) v1(8,19.87) v1(8.5,69.29) v1(8.54,52.75) v1(8.54,51.59) v1(9.05,21.03) v1(9.05,19.87) v1(9.69,52.75) v1(9.69,51.59) v1(10.2,21.03) v1(10.2,19.87) v1(10.5,67.22) v1(11.62,25.36) v1(11.62,24.2) v1(12.67,25.36) v1(12.67,24.2) v1(12.8,111.65) v1(12.8,110.5) v1(13.66,61.5) v1(13.66,60.34) v1(13.85,111.65) v1(13.85,110.5) v1(13.82,25.36) v1(13.82,24.2) v1(14.71,61.5) v1(14.71,60.34) v1(15,111.65) v1(15,110.5) v1(15.09,36.98) v1(15.24,16.13) v1(15.24,14.97) v1(15.87,61.5) v1(15.87,60.34) v1(16.16,64.78) v1(16.16,63.63) v1(16.29,16.13) v1(16.29,14.97) v1(17.21,64.78) v1(17.21,63.63) v1(17.19,54.24) v1(17.24,50.42) v1(17.44,37.89) v1(17.45,16.13) v1(17.45,14.97) v1(17.64,112.52) v1(17.64,111.36) v1(17.7,41.92) v1(18.31,37.89) v1(18.36,64.78) v1(18.36,63.63) v1(18.36,50.32) v1(18.69,112.52) v1(18.69,111.36) v1(18.72,41.26) v1(18.87,43.66) v1(19.48,54.55) v1(19.84,112.52) v1(19.84,111.36) v1(20.19,43.55) v1(20.25,79.87) v1(21.01,47.12) v1(21.32,80.12) v1(21.47,110.33) v1(21.47,109.17) v1(21.42,48.09) v1(21.47,6.75) v1(21.47,5.59) v1(21.93,48.71) v1(22.08,40.7) v1(22.52,110.33) v1(22.52,109.17) v1(22.52,6.75) v1(22.52,5.59) v1(22.85,79.97) v1(23.2,31.52) v1(23.36,33.15) v1(23.67,110.33) v1(23.67,109.17) v1(23.67,6.75) v1(23.67,5.59) v1(24.68,117.82) v1(24.68,116.67) v1(25.73,117.82) v1(25.73,116.67) v1(26.31,39.27) v1(26.42,64.31) v1(26.88,117.82) v1(26.88,116.67) v1(28,48.76) v1(28.41,72.93) v1(28.51,74.21) v1(28.61,100.08) v1(28.61,98.92) v1(28.76,97.68) v1(28.76,96.52) v1(28.81,95.44) v1(28.81,94.28) v1(28.81,75.12) v1(28.96,93.29) v1(28.96,92.14) v1(29.32,48.6) v1(29.66,100.08) v1(29.66,98.92) v1(29.81,97.68) v1(29.81,96.52) v1(29.86,95.44) v1(29.86,94.28) v1(30.01,93.29) v1(30.01,92.14) v1(30.34,77.88) v1(30.5,47.43) v1(30.81,100.08) v1(30.81,98.92) v1(30.96,97.68) v1(30.96,96.52) v1(31.01,95.44) v1(31.01,94.28) v1(31.16,93.29) v1(31.16,92.14) v1(31.92,100.13) v1(31.92,98.97) v1(32.07,97.68) v1(32.07,96.52) v1(32.07,95.54) v1(32.07,94.38) v1(32.23,93.34) v1(32.23,92.19) v1(32.74,122.93) v1(32.74,121.77) v1(32.97,100.13) v1(32.97,98.97) v1(33.12,97.68) v1(33.12,96.52) v1(33.12,95.54) v1(33.12,94.38) v1(33.28,93.34) v1(33.28,92.19) v1(33.3,74.41) v1(33.25,71.91) v1(33.79,122.93) v1(33.79,121.77) v1(34.12,100.13) v1(34.12,98.97) v1(34.12,72.98) v1(34.28,97.68) v1(34.28,96.52) v1(34.28,95.54) v1(34.28,94.38) v1(34.43,93.34) v1(34.43,92.19) v1(34.94,122.93) v1(34.94,121.77) v1(35.03,5.62) v1(35.03,4.47) v1(35.13,100.18) v1(35.13,99.02) v1(35.18,95.44) v1(35.18,94.28) v1(35.23,97.68) v1(35.23,96.52) v1(35.7,72.37) v1(35.8,93.29) v1(35.8,92.14) v1(36.08,5.62) v1(36.08,4.47) v1(36.18,100.18) v1(36.18,99.02) v1(36.29,97.68) v1(36.29,96.52) v1(36.23,95.44) v1(36.23,94.28) v1(36.36,37.57) v1(36.62,38.66) v1(36.85,93.29) v1(36.85,92.14) v1(36.82,65.38) v1(37.23,5.62) v1(37.23,4.47) v1(37.34,100.18) v1(37.34,99.02) v1(37.39,95.44) v1(37.39,94.28) v1(37.44,97.68) v1(37.44,96.52) v1(37.73,112.01) v1(37.73,110.85) v1(38,93.29) v1(38,92.14) v1(38.79,112.01) v1(38.79,110.85) v1(39.06,65.18) v1(39.17,35.7) v1(39.94,112.01) v1(39.94,110.85) v1(41.56,87.99) v1(41.56,86.83) v1(42.38,44.52) v1(42.43,35.09) v1(42.61,87.99) v1(42.61,86.83) v1(42.99,95.84) v1(42.99,94.69) v1(43.35,76.91) v1(43.55,98.65) v1(43.55,97.49) v1(43.76,87.99) v1(43.76,86.83) v1(43.76,47.28) v1(44.04,95.84) v1(44.04,94.69) v1(44.11,46) v1(44.6,98.65) v1(44.6,97.49) v1(44.78,73.85) v1(44.83,72.78) v1(44.83,62.99) v1(44.93,90.16) v1(44.93,89) v1(44.93,62.22) v1(45.08,83.39) v1(45.03,70.69) v1(45.03,59.26) v1(45.19,95.84) v1(45.19,94.69) v1(45.39,66.98) v1(45.44,10.57) v1(45.44,9.41) v1(45.59,58.14) v1(45.64,85.44) v1(45.64,84.28) v1(45.64,62.58) v1(45.75,98.65) v1(45.75,97.49) v1(45.98,90.16) v1(45.98,89) v1(45.98,50.98) v1(46.1,75.12) v1(46.05,73.24) v1(46.05,69.87) v1(46.31,72.42) v1(46.36,74.15) v1(46.49,10.57) v1(46.49,9.41) v1(46.56,70.53) v1(46.69,85.44) v1(46.69,84.28) v1(46.66,39.12) v1(46.76,67.05) v1(46.82,52.68) v1(46.82,38.2) v1(46.92,83.39) v1(47.02,62.78) v1(47.13,90.16) v1(47.13,89) v1(47.38,56.76) v1(47.68,106.81) v1(47.68,105.65) v1(47.64,10.57) v1(47.64,9.41) v1(47.84,85.44) v1(47.84,84.28) v1(47.89,55.59) v1(47.94,39.17) v1(48.73,106.81) v1(48.73,105.65) v1(49.21,38.96) v1(49.68,40.57) v1(49.88,106.81) v1(49.88,105.65) v1(50.13,42.02) v1(50.18,38.15) v1(50.8,41.21) v1(51,42.23) v1(50.94,5.22) v1(50.94,4.06) v1(51.1,52.48) v1(51.61,79.97) v1(51.99,5.22) v1(51.99,4.06) v1(52.07,56.3) v1(52.48,44.01) v1(52.71,36.38) v1(53.19,45.42) v1(53.15,5.22) v1(53.15,4.06) v1(53.55,70.99) v1(54.67,70.64) v1(56.38,42.35) v1(56.4,41.51) v1(56.65,36.38) v1(56.92,66.1) v1(57.88,66.1) v1(58.29,116.8) v1(58.29,115.65) v1(59,123.18) v1(59,122.02) v1(59.06,65.94) v1(59.31,62.93) v1(59.34,116.8) v1(59.34,115.65) v1(59.56,9.75) v1(59.56,8.6) v1(60.05,123.18) v1(60.05,122.02) v1(60.33,32.65) v1(60.33,31.5) v1(60.49,116.8) v1(60.49,115.65) v1(60.68,86.77) v1(60.68,85.61) v1(60.69,71.09) v1(60.61,9.75) v1(60.61,8.6) v1(61.2,123.18) v1(61.2,122.02) v1(61.14,101.66) v1(61.14,100.5) v1(61.35,106.45) v1(61.35,105.29) v1(61.35,99.41) v1(61.35,98.26) v1(61.38,32.65) v1(61.38,31.5) v1(61.74,86.77) v1(61.74,85.61) v1(61.77,9.75) v1(61.77,8.6) v1(62.19,101.66) v1(62.19,100.5) v1(62.4,106.45) v1(62.4,105.29) v1(62.4,99.41) v1(62.4,98.26) v1(62.53,32.65) v1(62.53,31.5) v1(62.89,86.77) v1(62.89,85.61) v1(63.35,101.66) v1(63.35,100.5) v1(63.55,106.45) v1(63.55,105.29) v1(63.55,99.41) v1(63.55,98.26) v1(64.31,87.89) v1(64.31,86.73) v1(64.97,99.57) v1(64.97,98.41) v1(65.12,24.29) v1(65.12,23.13) v1(65.27,102.32) v1(65.27,101.16) v1(65.33,95.54) v1(65.33,94.38) v1(65.36,87.89) v1(65.36,86.73) v1(65.63,92.68) v1(65.63,91.52) v1(65.89,121.85) v1(65.89,120.7) v1(65.84,90.13) v1(65.84,88.97) v1(66.02,99.57) v1(66.02,98.41) v1(66.17,24.29) v1(66.17,23.13) v1(66.33,102.32) v1(66.33,101.16) v1(66.38,95.54) v1(66.38,94.38) v1(66.51,87.89) v1(66.51,86.73) v1(66.68,92.68) v1(66.68,91.52) v1(66.89,90.13) v1(66.89,88.97) v1(66.94,121.85) v1(66.94,120.7) v1(67.17,99.57) v1(67.17,98.41) v1(67.32,24.29) v1(67.32,23.13) v1(67.48,102.32) v1(67.48,101.16) v1(67.42,70.53) v1(67.53,95.54) v1(67.53,94.38) v1(67.62,32.04) v1(67.62,30.88) v1(67.83,92.68) v1(67.83,91.52) v1(68.09,121.85) v1(68.09,120.7) v1(68.04,90.13) v1(68.04,88.97) v1(68.67,32.04) v1(68.67,30.88) v1(68.75,62.02) v1(68.85,63.85) v1(69.1,65.43) v1(69.82,32.04) v1(69.82,30.88) v1(73.13,118.03) v1(73.13,116.87) v1(74.18,118.03) v1(74.18,116.87) v1(74.35,108.03) v1(74.35,106.87) v1(74.61,36.48) v1(74.61,35.32) v1(75.33,118.03) v1(75.33,116.87) v1(75.4,108.03) v1(75.4,106.87) v1(75.66,36.48) v1(75.66,35.32) v1(76.56,108.03) v1(76.56,106.87) v1(76.6,25.87) v1(76.6,24.71) v1(76.81,36.48) v1(76.81,35.32) v1(77.46,103.85) v1(77.46,102.69) v1(77.65,25.87) v1(77.65,24.71) v1(78.51,103.85) v1(78.51,102.69) v1(78.8,25.87) v1(78.8,24.71) v1(79.67,103.85) v1(79.67,102.69) v1(81.34,113.69) v1(81.34,112.54) v1(82.39,113.69) v1(82.39,112.54) v1(83.54,113.69) v1(83.54,112.54) v1(88.94,105.94) v1(88.94,104.78) v1(89.99,105.94) v1(89.99,104.78) v1(91.14,105.94) v1(91.14,104.78) v1(95.47,102.98) v1(95.47,101.83) v1(96.52,102.98) v1(96.52,101.83) v1(97.61,31.23) v1(97.61,30.07) v1(97.61,15.98) v1(97.61,14.82) v1(97.67,102.98) v1(97.67,101.83) v1(97.76,48.16) v1(97.76,47) v1(98.07,65.09) v1(98.07,63.93) v1(98.66,31.23) v1(98.66,30.07) v1(98.66,15.98) v1(98.66,14.82) v1(98.81,48.16) v1(98.81,47) v1(99.12,65.09) v1(99.12,63.93) v1(99.81,31.23) v1(99.81,30.07) v1(99.81,15.98) v1(99.81,14.82) v1(99.96,48.16) v1(99.96,47) v1(100.27,65.09) v1(100.27,63.93)
VCC_10V: length 31.2
  Top Layer w0.6: R8.2 45.24,77.96 v1(45.19,78.01) ; D4.1 25.96,95.14 26.72,94.38 26.72,90.45 v1(30.45,86.73)
  Bottom Layer w0.6: v1(45.19,78.01) 36.46,86.73 v1(30.45,86.73)
VCC_LIMT: length 91.9
  Top Layer w0.4: 77.2,83.21 70.57,83.21 68.71,81.35 ; 77.2,83.21 77.1,83.31 P1.3 ; 77.2,83.21 85.43,83.21 87.56,85.34 P3.3 ; 68.71,81.35 67.42,82.64 R6.1 63.73,82.64 63.53,82.43 58.45,82.43 ; 68.71,81.35 R19.1 ; R3.2 66.53,105.46 77.1,94.89 P2.3
  Top Layer w0.6: R4.2 58.45,85.75 58.45,82.43
  Bottom Layer w0.4: P6.3 P8.3 98.14,94.37 96.05,96.47 89.65,96.47 87.56,94.37 P5.3 P3.3 ; P1.3 P2.3
VIN24V: length 17.2
  Top Layer w2.2: 36.52,118.73 36.52,114.52 33.81,111.82 27.75,111.82 DC1.1
340_R: length 13.7
  Top Layer w0.3: v1(30.09,35.88) 30.28,36.07 R58.1 32.03,37.16 D14.2 ; U20.3 24.11,34.73 v1(24.12,34.71)
  Bottom Layer w0.3: v1(30.09,35.88) 28.92,34.71 v1(24.12,34.71)
340_T: length 13.3
  Top Layer w0.3: U20.2 23.93,36 v1(24.12,36.19) ; D15.1 31.47,38.33 v1(30.34,38.33)
  Bottom Layer w0.3: v1(30.34,38.33) 26.27,38.33 v1(24.12,36.19)
A_1A: length 26.2
  Top Layer w0.4: H11.4 82.98,68.36 81.47,69.87 R54.2
  Bottom Layer w1.2: P16.3 87.55,74.06 82.98,69.49 H11.4
A_1B: length 30.1
  Top Layer w0.4: R55.2 79.46,69.81 79.46,68.68 80.44,67.7 H11.3
  Bottom Layer w1.2: H11.3 80.44,70.37 86.67,76.6 P16.4
A_2A: length 22.3
  Top Layer w0.4: H11.5 85.52,67.84 83.49,69.87 R53.2
  Bottom Layer w1.2: P16.2 88.48,71.52 85.52,68.56 H11.5
A_2B: length 18.2
  Top Layer w0.4: H11.6 88.06,67.26 85.45,69.86 R52.2
  Bottom Layer w1.2: H11.6 88.06,67.33 89.71,68.98 P16.1
A_DIR_O: length 35.9
  Top Layer w0.4: U19.4 67.8,48.24 70.48,50.93 70.48,65 75.36,69.88 H10.1
A_STEP_O: length 43.2
  Top Layer w0.4: H10.2 77.9,71.09 71.15,64.34 71.15,43.07 69.42,41.35 U15.15
BOOT0: length 4.9
  Top Layer w0.3: U10.44 39.27,39.21 R31.1
BOOT1: length 9.7
  Top Layer w0.3: R32.1 v1(59.42,43.33) ; 59.42,41.85 58.28,40.71 U10.20
  Bottom Layer w0.3: v1(59.42,43.33) 59.42,41.9 v1(59.36,41.85)
D1+: length 5.4
  Top Layer w0.5: USB1.3 14.27,52.03 16.7,52.03 17.32,51.41 D12.3
D1-: length 5.4
  Top Layer w0.5: D12.1 17.32,53.31 16.7,52.68 14.27,52.68 USB1.2
DN-: length 9
  Top Layer w0.3: v1(9.23,32.21) 9.16,32.14 USB2.5 ; D13.3 12.73,30.49 12.08,31.14 USB2.7
  Bottom Layer w0.3: v1(9.23,32.21) v1(9.23,31.09)
DN_D-: length 4.7
  Top Layer w0.3: D13.4 16.97,30.49 17.75,31.28 18.52,31.28 18.88,30.92 U20.6
DP+: length 9.5
  Top Layer w0.3: D13.1 12.83,32.39 12.08,31.64 USB2.6 6.73,31.64 6.43,31.34 6.43,30.93 6.72,30.64 USB2.8
DP_D+: length 4.6
  Top Layer w0.3: D13.6 17.18,32.39 17.75,31.83 18.52,31.83 18.88,32.19 U20.5
DTR: length 4.6
  Top Layer w0.3: C30.2 30.28,33.46 U20.13
INT: length 16.3
  Top Layer w0.3: v1(43.55,54.75) 47.25,51.06 U10.33
  Top Layer w0.4: R35.1 41.72,57.06 v1(41.72,56.64)
  Bottom Layer w0.4: v1(41.72,56.64) 43.55,54.8 v1(43.55,54.75)
INT_CH: length 17.6
  Top Layer w0.4: R35.2 40.85,60.11 v1(40.29,60.67) ; U16.1 v1(30.04,62.75)
  Bottom Layer w0.4: v1(30.04,62.75) 38.21,62.75 v1(40.29,60.67)
LA_CNC_SW: length 21.7
  Top Layer w0.5: P11.1 27.9,14.66 D11.2 27.95,14.96 29.55,16.56 U12.2 34.57,16.56 40.49,10.64 P13.3
LASER_CNC: length 22.7
  Top Layer w0.3: U12.4 37.84,19.16 37.84,32.06 41.92,36.14 41.92,37.56 42.57,38.21 U10.46
LED_RUN: length 10.2
  Top Layer w0.3: D9.2 35.02,41.58 v1(35.7,42.26) ; U10.38 43.19,42.21 v1(42.59,42.82)
  Bottom Layer w0.3: v1(42.59,42.82) 42.02,42.26 v1(35.7,42.26)
M_EN_O: length 139
  Top Layer w0.4: v1(73.08,68.93) 73.08,79.03 74.31,80.25 91.79,80.25 H10.8 ; U11.4 v1(69.82,53.45) ; v1(72.32,63.37) 91.75,63.37 H8.8
  Bottom Layer w0.3: 69.82,46.75 91.61,46.75 H6.8
  Bottom Layer w0.4: v1(73.08,68.93) 72.32,68.17 v1(72.32,63.37) 69.82,60.87 v1(69.82,53.45) 69.82,34.66 74.66,29.81 91.79,29.81 H3.8
MA_DIR: length 19.3
  Top Layer w0.3: U10.17 56.73,39.21 v1(57.12,39.6) ; U19.2 60.4,49.19 60.16,49.43 R49.1 58.53,49.43 v1(57.68,48.58)
  Bottom Layer w0.3: v1(57.68,48.58) 57.68,40.17 v1(57.12,39.6)
MA_STEP: length 10.1
  Top Layer w0.3: U15.2 60.14,41.35 57.5,38.71 U10.16
MOTOR_EN: length 27
  Top Layer w0.3: U11.2 64.06,54.4 v1(63.9,54.24) ; U10.28 49.75,46.41 56.92,53.58 v1(58.24,53.58) ; R26.2 v1(63.9,57.61)
  Bottom Layer w0.3: v1(58.24,53.58) 63.24,53.58 v1(63.9,54.24) v1(63.9,57.61)
MX_DIR: length 17.8
  Top Layer w0.3: U18.2 58.95,27.88 R44.1 58.87,31.99 57.94,32.92 51.46,32.92 50.25,34.13 U10.10
MX_STEP: length 12.8
  Top Layer w0.3: U10.11 50.75,34.55 51.2,34.1 58.09,34.1 58.99,35 U15.7
MY_DIR: length 10.8
  Top Layer w0.3: U15.6 60.11,36.27 59.5,35.66 U10.12
MY_STEP: length 9.2
  Top Layer w0.3: U10.13 58.81,37.21 59.14,37.54 U15.5
MZ_DIR: length 9.5
  Top Layer w0.3: 61.83,38.81 59.34,38.81 58.24,37.71 U10.14
MZ_STEP: length 9.8
  Top Layer w0.3: U15.3 59.59,40.08 57.72,38.21 U10.15
NRST: length 11.2
  Top Layer w0.3: C15.2 55.03,30.84 R33.1 51.51,30.88 48.75,33.64 U10.7
PB1: length 3.3
  Top Layer w0.3: v1(56,39.96) 55.75,40.21 U10.19
PB7: length 10.2
  Top Layer w0.3: U10.43 40.61,39.71 v1(40.24,40.09)
  Bottom Layer w0.3: v2(36.36,35.65) 36.36,36.21 v1(40.24,40.09)
PC13: length 4.4
  Top Layer w0.3: v1(43.3,33.94) 45.73,33.94 46.25,34.46 U10.2
PC14: length 6.2
  Top Layer w0.3: v1(42.33,33.18) 45.61,33.18 46.75,34.32 U10.3
PC15: length 8.1
  Top Layer w0.3: U10.4 47.25,33.87 45.9,32.52 v1(41.51,32.52)
PROBE: length 22.8
  Top Layer w0.3: R24.2 56.39,22.21 U13.4 53.18,24.09 v1(53.19,24.1) ; U10.18 51.72,39.71 v1(51.41,39.4)
  Bottom Layer w0.3: v1(51.41,39.4) 51.41,34.76 53.19,32.97 v1(53.19,24.1)
PROBE_OUT: length 14.1
  Top Layer w0.5: D8.1 50.44,14.29 U14.1 52.81,13.94 54.47,15.6 D10.2 55.21,15.84 55.67,16.3 H2.1
PWM: length 34.7
  Top Layer w0.3: U6.1 49.73,69.74 R9.2 52.85,69.73 54.57,68.01 54.57,60.41 52.07,57.91 50.69,57.91 50.08,57.3 U22.2 50.08,55.26 49.25,54.43 U10.29
PWM_5V: length 52.4
  Top Layer w0.5: v1(50.44,61.13) 51.03,60.53 U22.4 ; CN1.1 16.62,79.24 v1(19.69,76.17)
  Bottom Layer w0.5: v1(19.69,76.17) 31.87,63.98 39.32,63.98 42.18,61.13 v1(50.44,61.13)
PWM_10V: length 50.2
  Top Layer w0.4: U6.4 48.58,78.51 R8.1
  Top Layer w0.6: v1(23.97,86.22) 24.53,86.78 R7.2
  Bottom Layer w0.4: v1(23.97,86.22) 28.2,81.99 39.58,81.99 44.42,77.14 47.28,77.14 v1(48.65,78.52)
  Bottom Layer w0.6: P4.2 19.17,91.02 v1(23.97,86.22)
R2IN: length 11
  Top Layer w0.5: 15.21,69.93 16.96,69.93 19.64,67.24 U21.8
R2OUT: length 3.8
  Top Layer w0.4: 34.23,66.99 33.99,67.24 U21.9
RS232_VCC: length 6.1
  Top Layer w0.5: U21.16 34.63,76.13 R56.1 R57.1
RST: length 15.4
  Top Layer w0.3: C30.1 38.45,33.48 41.41,36.44 41.41,37.72 42.41,38.71 U10.45
RST_CH: length 4.7
  Top Layer w0.3: R34.2 21.09,63.13 22.74,61.48 U16.2
RXD1: length 16.7
  Top Layer w0.3: v1(38.51,41.54) 37.34,41.54 R51.1 37.13,41.65 34.63,39.15 ; v1(46.82,41.54) 48.25,42.98 U10.31
  Bottom Layer w0.3: v1(46.82,41.54) v1(38.51,41.54)
RXD3: length 41.1
  Top Layer w0.3: U10.22 54.23,41.71 v1(54.52,42)
  Top Layer w0.4: R61.2 40.04,66.99 v1(40.14,66.89)
  Bottom Layer w0.3: H5.2 54.52,59.35 v1(54.52,42)
  Bottom Layer w0.4: H5.2 42.94,64.09 v1(40.14,66.89)
SCK: length 4.6
  Top Layer w0.3: U16.20 37.9,52.59 38.72,51.77 R39.1
SDI: length 4.3
  Top Layer w0.3: R38.1 37.92,53.38 37.43,53.86 U16.21
SDO: length 4.2
  Top Layer w0.3: R37.1 37.97,55.01 37.84,55.13 U16.22
SM_XC: length 76.3
  Top Layer w0.3: v1(43.61,67.71) 43.61,58.02 47.75,53.87 U10.32 ; v1(19.99,85.81) 19.99,89.43 16.58,92.84 U8.1 ; v1(19.99,82.9) 22.03,80.86 34.64,80.86 34.64,79.58 v1(34.88,79.33)
  Bottom Layer w0.3: v1(19.99,82.9) v1(19.99,85.81) ; v1(34.88,79.33) 39.27,79.33 43.61,75 v1(43.61,67.71)
SM_XC_OUT: length 11.6
  Top Layer w0.4: R16.1 16.59,104.06 U8.4
  Top Layer w0.6: U8.4 15.63,104.06 14.28,102.7 P7.2
SPI1_CS: length 16.4
  Top Layer w0.3: U10.42 41.88,40.21 39.42,42.66 39.42,47.26 36.63,50.05 U16.18
SPI1_MISO: length 17.4
  Top Layer w0.3: 40.18,55.01 40.18,54.98 42.13,53.03 42.13,46.29 45.7,42.72 45.7,41.59 45.31,41.21 U10.40
SPI1_MOSI: length 16.1
  Top Layer w0.3: v1(40.44,42.92) 42.65,40.71 U10.41 ; v1(40.9,44.81) 40.9,51.16 40.93,51.19 40.93,52.3 40.9,52.33 40.9,53.27 40.8,53.38 R38.2
  Bottom Layer w0.3: v1(40.9,44.81) 40.9,43.38 v1(40.44,42.92)
SPI1_SCK: length 12.5
  Top Layer w0.3: U10.39 42.72,41.71 40.23,44.21 R39.2
SWCLK: length 22.7
  Top Layer w0.3: U10.37 v1(44.2,43.38) ; v1(53.55,57.51) 54.83,58.79 H1.3
  Bottom Layer w0.3: v1(44.2,43.38) 53.09,52.27 53.09,57.05 v1(53.55,57.51)
SWDIO: length 20.3
  Top Layer w0.3: U10.34 46.75,42.88 v1(46.77,42.87) ; H1.4 55.94,55.12 v1(53.81,55.12)
  Bottom Layer w0.3: v1(46.77,42.87) 46.77,45.31 53.81,52.35 v1(53.81,55.12)
T2IN: length 3.8
  Top Layer w0.4: 34.23,68.68 34.07,68.51 U21.10
T2OUT: length 13.6
  Top Layer w0.5: 13.21,69.93 14.61,71.33 17.08,71.33 19.9,68.51 U21.7
TXD1: length 18.8
  Top Layer w0.3: v1(47.89,41.39) 48.75,42.25 U10.30 ; v1(38.1,40.73) 37.03,40.73 35.7,39.4 35.7,38.36 34.7,37.36 D14.1
  Bottom Layer w0.3: v1(38.1,40.73) 47.23,40.73 v1(47.89,41.39)
TXD3: length 44.9
  Top Layer w0.3: U10.21 55.06,41.21 v1(55.23,41.39)
  Top Layer w0.4: R60.2 39.83,68.68 v1(40.7,67.81)
  Bottom Layer w0.3: v1(55.23,41.39) 55.23,59.95 52.32,62.87 H5.1
  Bottom Layer w0.4: H5.1 50.28,66.13 42.38,66.13 v1(40.7,67.81)
U_D+: length 4.3
  Top Layer w0.5: U16.10 21.64,51.32 21.55,51.41 D12.4
U_D-: length 8.9
  Top Layer w0.5: U16.11 20.51,50.05 19.63,50.93 19.63,52.71 20.23,53.31 D12.6
VKA: length 5.5
  Top Layer w0.4: R10.1 22.66,88.87 R11.2 22.66,91.93 U7.2 20.55,92.1 R13.1
X_1A: length 23.9
  Top Layer w0.4: 80.58,19.1 80.61,19.1 82.98,16.73 H4.4
  Bottom Layer w1.2: H4.4 82.98,17.27 88.72,23.01 98.12,23.01
X_1B: length 27.4
  Top Layer w0.4: 78.61,19.1 78.64,19.1 80.44,17.3 H4.3
  Bottom Layer w1.2: P12.4 88.51,25.55 80.44,17.48 H4.3
X_2A: length 20.4
  Top Layer w0.4: 82.55,19.1 82.58,19.1 85.52,16.17 H4.5
  Bottom Layer w1.2: H4.5 85.52,17.1 88.88,20.47 P12.2
X_2B: length 16.6
  Top Layer w0.4: H4.6 88.06,16.17 85.12,19.1 85.09,19.1
  Bottom Layer w1.2: H4.6 88.06,16.74 89.25,17.93 P12.1
X_DIR_O: length 11.6
  Top Layer w0.4: H3.1 73.83,26.93 64.38,26.93
X_LIMT: length 34.6
  Top Layer w0.3: U10.27 50.25,45.84 56.3,51.9 57.99,51.9 60.54,54.45 60.54,68.57 59.38,69.73 R1.2 58.36,69.75 U3.4
X_LIMT_I: length 28.9
  Top Layer w0.4: v1(56.25,80.46) 55.81,80.02 U3.2
  Bottom Layer w0.4: v1(56.25,80.46) 58.75,82.96 69.97,82.96 72.02,85.01 P1.1 P2.1
X_STEP_O: length 13.3
  Top Layer w0.4: U15.10 69.27,35 73.62,30.65 75.71,30.65 H3.2
XTAL1: length 14.3
  Top Layer w0.3: C9.2 41.48,29.03 Y1.1 43.55,29.25 47.75,33.45 U10.5
XTAL2: length 12.1
  Top Layer w0.3: C8.2 50.32,28.46 51.12,29.25 ; 51.12,29.25 Y1.2 ; 51.12,29.25 50.51,29.25 48.25,31.51 U10.6
Y_1A: length 23
  Top Layer w0.4: H7.4 82.98,35.43 R42.2
  Bottom Layer w1.2: H7.4 82.98,34.35 88.65,40.03 P14.3
Y_1B: length 27
  Top Layer w0.4: R43.2 80.89,32.87 H7.3
  Bottom Layer w1.2: P14.4 88.08,42.57 80.44,34.92 H7.3
Y_2A: length 19.6
  Top Layer w0.4: H7.5 84.3,33.64 R41.2
  Bottom Layer w1.2: H7.5 85.52,33.98 89.02,37.49 P14.2
Y_2B: length 16.1
  Top Layer w0.4: H7.6 88.06,34 86.12,35.94 R40.2
  Bottom Layer w1.2: H7.6 88.06,33.52 89.49,34.95 P14.1
Y_DIR_O: length 15.6
  Top Layer w0.4: v1(73.29,36.6) 72.96,36.27 U15.11 ; v1(73.64,38.84) 75.36,40.55 H6.1
  Bottom Layer w0.4: v1(73.64,38.84) 73.64,36.95 v1(73.29,36.6)
Y_LIMT: length 35.6
  Top Layer w0.3: U10.26 50.75,45.53 56.56,51.34 58.19,51.34 61.35,54.5 61.35,68.17 62.92,69.73 R5.2 64.57,69.78 U4.4
Y_LIMT_I: length 32.1
  Top Layer w0.4: v1(62.32,80.2) 62.03,79.91 U4.2
  Bottom Layer w0.4: v1(62.32,80.2) 64.31,82.19 77.93,82.19 82.48,86.74 P3.1 P5.1
Y_STEP_O: length 15.7
  Top Layer w0.4: H6.2 77.9,41.92 73.52,37.54 U15.12
Z_1A: length 23.7
  Top Layer w0.4: R47.2 82.21,49.95 H9.4
  Bottom Layer w1.2: H9.4 82.98,52.3 87.72,57.04 P15.3
Z_1B: length 27.3
  Top Layer w0.4: H9.3 80.12,49.5 R48.2
  Bottom Layer w1.2: P15.4 97.8,59.26 86.92,59.26 80.44,52.77 H9.3
Z_2A: length 19.8
  Top Layer w0.4: H9.5 85.52,50.93 84.13,52.32 R46.2
  Bottom Layer w1.2: P15.2 88.7,54.5 85.52,51.32 H9.5
Z_2B: length 15.9
  Top Layer w0.4: H9.6 88.06,50.53 86.27,52.32 R45.2
  Bottom Layer w1.2: H9.6 88.06,50.45 89.57,51.96 P15.1
Z_DIR_O: length 27.8
  Top Layer w0.4: v1(71.86,41.24) 69.43,38.81 67.3,38.81 ; v1(71.86,44.09) 71.86,53.27 75.36,56.77 H8.1
  Bottom Layer w0.4: v1(71.86,44.09) v1(71.86,41.24)
Z_LIMT: length 37.8
  Top Layer w0.3: U9.4 70.78,69.79 R18.2 69.5,69.73 66.96,67.2 66.96,59.29 58.45,50.77 56.66,50.77 51.25,45.36 U10.25
Z_LIMT_I: length 36.2
  Top Layer w0.4: v1(68.49,79.84) 68.24,79.59 U9.2
  Bottom Layer w0.4: v1(68.49,79.84) 69.97,81.32 87.6,81.32 93.06,86.79 P6.1 P8.1
Z_STEP_O: length 27.4
  Top Layer w0.4: H8.2 77.9,57.73 72.88,52.71 72.88,43.68 69.28,40.08 U15.14
$1N101900: length 10.9
  Top Layer w0.6: L1.2 52.23,99.32 D5.2
  Top Layer w1: 57.53,95.07 55.14,95.07 L1.2
$1N101901: length 3.5
  Top Layer w0.4: R15.2 58.34,90.61 57.53,91.42 57.53,92.53
$1N101905: length 3.7
  Top Layer w0.5: C29.1 18.46,33.46 U20.4
$1N101952: length 4.2
  Top Layer w0.5: U21.6 22.65,69.78 C36.1
$1N101955: length 4.8
  Top Layer w0.5: C31.2 21.36,77 23.5,74.86 U21.2
$1N101956: length 5.5
  Top Layer w0.5: U21.4 23.54,72.32 22.49,73.37 22.49,74.29 21.76,75.01 21.21,75.01
$1N101957: length 5.2
  Top Layer w0.5: C35.2 21.21,73.17 23.33,71.05 U21.5
$1N101958: length 2.6
  Top Layer w0.5: C32.1 25.06,78.01 U21.1
$1N101959: length 6.5
  Top Layer w0.5: C32.2 26.97,74.17 26.38,73.59 U21.3
$1N102032: length 2.5
  Top Layer w0.4: H3.4 H3.3
$1N102065: length 2.5
  Top Layer w0.4: H6.4 H6.3
$1N102097: length 2.5
  Top Layer w0.4: H8.4 H8.3
$1N102141: length 2.5
  Top Layer w0.4: R2.2 58.45,78.6 U3.1
$1N102179: length 2.6
  Top Layer w0.4: U4.1 64.57,78.51 R6.2
$1N102187: length 3.1
  Top Layer w0.4: R19.2 70.78,80.76 U9.1
$1N102195: length 2.3
  Top Layer w0.3: 44.46,22.21 46.78,22.21 U13.1
$1N102197: length 3.1
  Top Layer w0.5: U13.2 47.53,19.67 48.09,19.1 D8.2
$1N102200: length 1.8
  Top Layer w0.4: LED1.2 R12.1
$1N102201: length 1.6
  Top Layer w0.3: LED2.2 64.81,116.79 R14.1
$1N102245: length 2.5
  Top Layer w0.4: H10.4 H10.3
$1N102298: length 1.9
  Top Layer w0.4: LED3.2 11.37,40.95 R59.2
$1N102299: length 11.9
  Top Layer w0.3: C34.2 23.7,23.84 Y3.2 23.86,27.98 22.2,29.65 U20.7
$1N102300: length 9.2
  Top Layer w0.3: U20.8 19.58,28.38 18.26,27.06 18.26,24 18.17,23.91 C37.2
$1N103100: length 4.5
  Top Layer w0.4: R13.2 20.65,94 U7.1 22.48,96.14 R20.1
$1N107518: length 1.6
  Top Layer w0.6: D4.2 26.01,98.77 D3.1
$1N112774: length 2.1
  Top Layer w0.3: R21.2 31.36,19.11 U12.1
$1N113148: length 1.8
  Top Layer w0.4: R7.1 24.53,90.13 R11.1
$1N114414: length 2.1
  Top Layer w0.4: R25.2 33.26,41.76 D9.1
$1N114812: length 11.3
  Top Layer w0.4: C21.2 29,42.35 Y2.2
  Top Layer w0.5: U16.13 27.18,47.51 29.32,45.37 Y2.2
$1N114826: length 7.6
  Top Layer w0.4: Y2.1 23.72,39.44 C24.2
  Top Layer w0.5: U16.14 25.04,43.99 Y2.1
$1N114930: length 4.3
  Top Layer w0.4: R36.1 37.93,57.93 37.67,57.67 U16.24

## Copper pours and planes (outline as drawn; the poured copper is in the pictures)
24V_VCC on Top Layer: 47.18,121.05 50.63,121.05 50.63,117.08 47.18,117.08
GND on Top Layer: -3.27,129.13 104.6,129.13 104.6,-1.89 -3.27,-1.89
GND on Bottom Layer: -3.27,129.13 104.6,129.13 104.6,-1.89 -3.27,-1.89

Small or netless copper shapes (teardrops, artwork), in the pictures only: 529 on Top Layer, 159 on Bottom Layer

## Text on the board
Bottom Silkscreen Layer: GND | Z_MOTOR | Y_MOTOR | X_MOTOR | X1_LIMIT | Y2_LIMIT | Y1_LIMIT | Z2_LIMIT | Z1_LIMIT
Top Silkscreen Layer: A_MOTOR | 24V | 连接触摸屏 | 连接电脑USB | U盘 | 拨码开关CNC切换 | 电源输入 | 船形开关 | 急停开关 | 对刀接口 | 吸尘器开关信号 | 变频器接口 | 激光器接口 | RX | TX | 第四轴 | GND | PWM | SW_XC | PWM_10V | 3V3 | CLK | DIO
